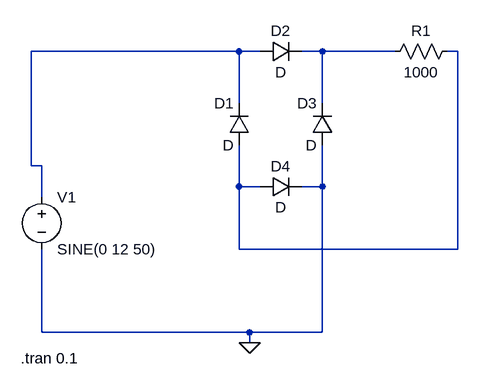
[diagram p0: schematic WMPC.asc]
WMPC.asc, the LTspice schematic file:
Version 4
SHEET 1 880 680
WIRE 368 -128 48 -128
WIRE 400 -128 368 -128
WIRE 496 -128 464 -128
WIRE 608 -128 496 -128
WIRE 704 -128 688 -128
WIRE 368 -48 368 -128
WIRE 496 -48 496 -128
WIRE 48 48 48 -128
WIRE 64 48 48 48
WIRE 368 80 368 16
WIRE 400 80 368 80
WIRE 496 80 496 16
WIRE 496 80 464 80
WIRE 64 96 64 48
WIRE 368 176 368 80
WIRE 704 176 704 -128
WIRE 704 176 368 176
WIRE 64 304 64 176
WIRE 384 304 64 304
WIRE 496 304 496 80
WIRE 496 304 384 304
WIRE 384 320 384 304
FLAG 384 320 0
SYMBOL voltage 64 80 R0
WINDOW 123 0 0 Left 0
WINDOW 39 0 0 Left 0
SYMATTR InstName V1
SYMATTR Value SINE(0 12 50)
SYMBOL diode 384 16 R180
WINDOW 0 24 64 Left 2
WINDOW 3 24 0 Left 2
SYMATTR InstName D1
SYMBOL diode 512 16 R180
WINDOW 0 24 64 Left 2
WINDOW 3 24 0 Left 2
SYMATTR InstName D3
SYMBOL diode 400 -112 R270
WINDOW 0 32 32 VTop 2
WINDOW 3 0 32 VBottom 2
SYMATTR InstName D2
SYMBOL diode 400 96 R270
WINDOW 0 32 32 VTop 2
WINDOW 3 0 32 VBottom 2
SYMATTR InstName D4
SYMBOL res 704 -144 R90
WINDOW 0 0 56 VBottom 2
WINDOW 3 32 56 VTop 2
SYMATTR InstName R1
SYMATTR Value 1000
TEXT 32 344 Left 2 !.tran 0.1

The netlist it stands for:
* WMPC.asc
V1 N001 0 SINE(0 12 50)
D1 N003 N001 D
D3 0 N002 D
D2 N001 N002 D
D4 N003 0 D
R1 N003 N002 1000
.model D D
.lib standard.dio
.tran 0.1
.backanno
.end